# Altium schematic sheet wifi-bt.SchDoc
size A
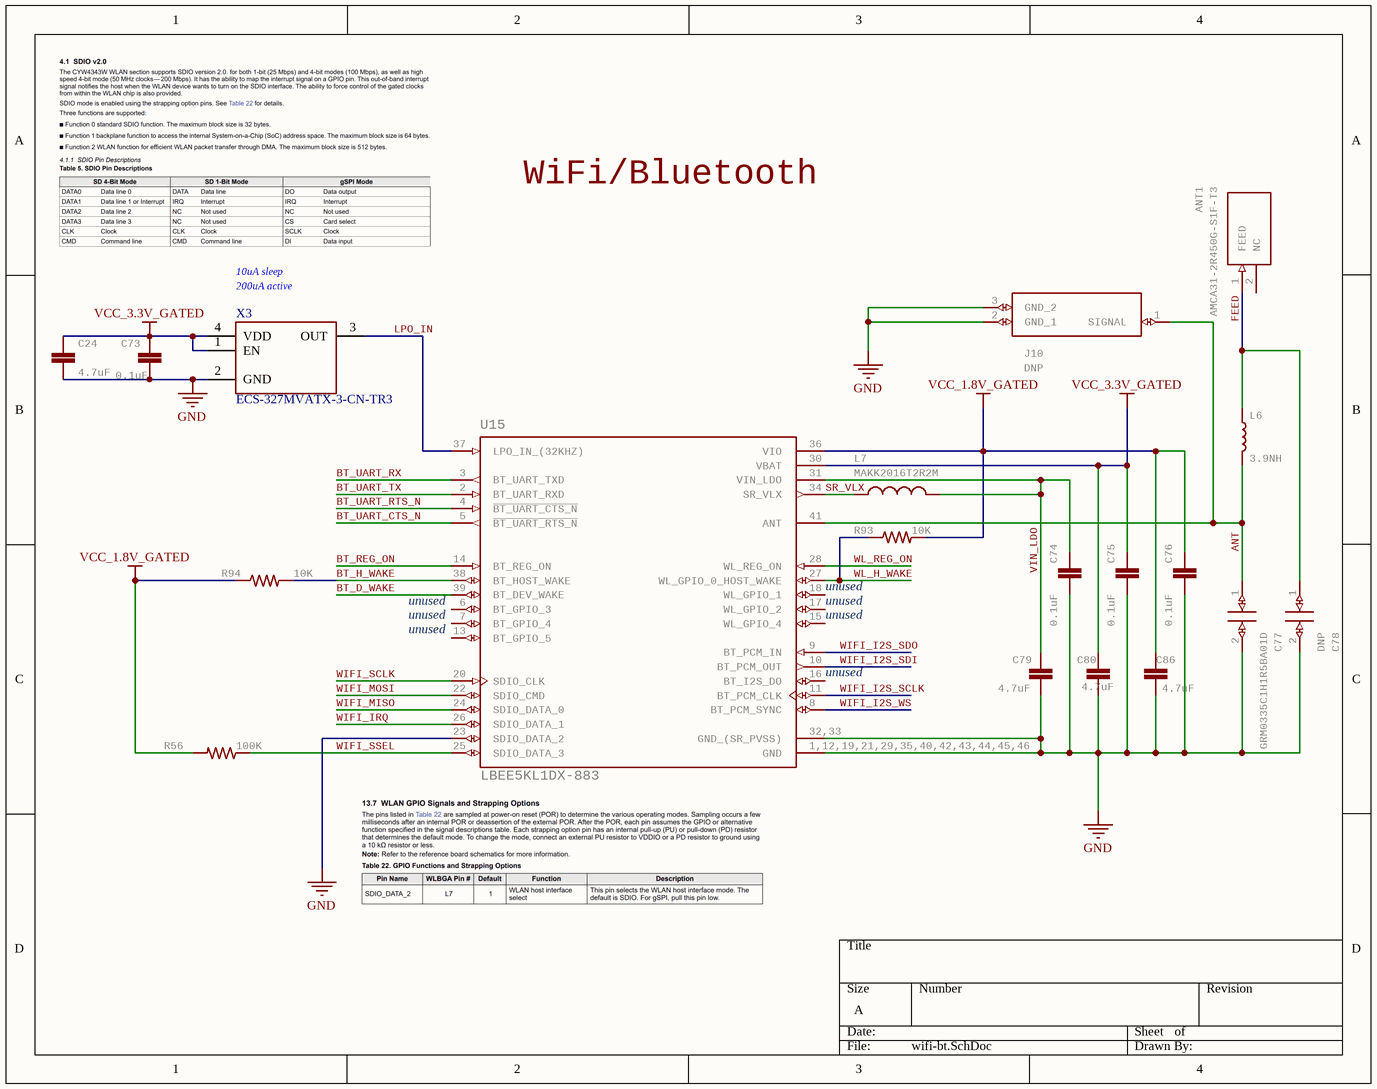
[diagram p0: wifi-bt.SchDoc]

## Parts
ANT1  AMCA31-2R450G-S1F-T3  [ANTC3216X140N]
C24  4.7uF  [0402-CAP]
C73  0.1uF  [0402-CAP]
C74  0.1uF  [0402-CAP]
C75  0.1uF  [0402-CAP]
C76  0.1uF  [0402-CAP]
C77  GRM0335C1H1R5BA01D  [CAPC0603X33N]
C78  DNP  [C0201-NO-3D]
C79  4.7uF  [0402-CAP]
C80  4.7uF  [0402-CAP]
C86  4.7uF  [0402-CAP]
J10  DNP  [23370191-NO-3D]
L6  3.9NH  [0402]
L7  MAKK2016T2R2M  [INDC2016X100N]
R56  100K  [0402-RES]
R93  10K  [0402-RES]
R94  10K  [0402-RES]
U15  LBEE5KL1DX-883  [XCVR_LBEE5KL1DX-TEMP]
X3  ECS-327MVATX-3-CN-TR3  [XTAL_3225]

## Nets
GND: C24.1 C73.2 C74.2 C75.2 C76.2 C77.2 C78.2 C79.1 C80.1 C86.1 J10.2(GND_1) J10.3(GND_2) U15.1,12,19,21,29,35,40,42,43,44,45,46(GND) U15.23(SDIO_DATA_2) U15.32,33(GND_(SR_PVSS)) X3.2(GND)
VCC_1.8V_GATED: C76.1 C86.2 R56.2 R93.2 R94.1 U15.36(VIO)
VCC_3.3V_GATED: C24.2 C73.1 C75.1 C80.2 U15.30(VBAT) X3.1(EN) X3.4(VDD)
ANT: C77.1 J10.1(SIGNAL) L6.2 U15.41(ANT)
BT_D_WAKE: U15.39(BT_DEV_WAKE)
BT_H_WAKE: R94.2 U15.38(BT_HOST_WAKE)
BT_REG_ON: U15.14(BT_REG_ON)
BT_UART_CTS_N: U15.5(~{BT_UART_RTS_N})
BT_UART_RTS_N: U15.4(~{BT_UART_CTS_N})
BT_UART_RX: U15.3(BT_UART_TXD)
BT_UART_TX: U15.2(BT_UART_RXD)
FEED: ANT1.1(FEED) C78.1 L6.1
LPO_IN: U15.37(LPO_IN_(32KHZ)) X3.3(OUT)
SR_VLX: L7.1 U15.34(SR_VLX)
VIN_LDO: C74.1 C79.2 L7.2 U15.31(VIN_LDO)
WIFI_I2S_SCLK: U15.11(BT_PCM_CLK)
WIFI_I2S_SDI: U15.10(BT_PCM_OUT)
WIFI_I2S_SDO: U15.9(BT_PCM_IN)
WIFI_I2S_WS: U15.8(BT_PCM_SYNC)
WIFI_IRQ: U15.26(SDIO_DATA_1)
WIFI_MISO: U15.24(SDIO_DATA_0)
WIFI_MOSI: U15.22(SDIO_CMD)
WIFI_SCLK: U15.20(SDIO_CLK)
WIFI_SSEL: R56.1 U15.25(SDIO_DATA_3)
WL_H_WAKE: R93.1 U15.27(WL_GPIO_0_HOST_WAKE)
WL_REG_ON: U15.28(WL_REG_ON)

Not connected (* = marked no-connect by the designer): ANT1 2(NC); U15 6(BT_GPIO_3) 7(BT_GPIO_4) 13(BT_GPIO_5) 15(WL_GPIO_4) 16(BT_I2S_DO) 17(WL_GPIO_2) 18(WL_GPIO_1)

## Notes on the sheet
- WiFi/Bluetooth
- 10uA sleep
- (near X3) 200uA active
- (near U15) unused
- unused

## Library data of the parts
ANT1 = AMCA31-2R450G-S1F-T3: ABRACON - AMCA31-2R450G-S1F-T3 - ANTENNA, CHIP, 2.45GHZ, 50 OHM, 1206   Source:  Datasheet; GateName_1: G$1; SymbolName_1: AMCA31-2R450G-S1F-T3; LibraryName: AMCA31-2R450G-S1F-T3; DeviceSetName: AMCA31-2R450G-S1F-T3; HEIGHT: 1.4mm; MANUFACTURER_NAME: ABRACON; MANUFACTURER_PART_NUMBER: AMCA31-2R450G-S1F-T3; MOUSER_PART_NUMBER: 815-CA312R450GS1FT3; MOUSER_PRICE-STOCK: https://www.mouser.co.uk/ProductDetail/ABRACON/AMCA31-2R450G-S1F-T3?qs=AAveGqk956GLuOddQEK40Q%3D%3D; MPN: AMCA31-2R450G-S1F-T3; Part Number: AMCA31-2R450G-S1F-T3
C24 C79 C80 C86 = CAP0402-CAP: CapacitorStandard 0603 ceramic capacitor, and 0.1" leaded capacitor.; MPN: JMK105BBJ475MV-F; GateName_1: G$1; SymbolName_1: CAP; DeviceName: 0402-CAP; LibraryName: sfe; DeviceSetName: CAP; Part Number: JMK105BBJ475MV-F
C73-C76 = C-EUC0201: CAPACITOR, European symbol; MPN: C0402C104Z4VAC; GateName_1: G$1; SymbolName_1: C-EU; POPULARITY: 0; LibraryName: rcl; DeviceSetName: C-EU; SPICEPREFIX: C; Part Number: C0402C104Z4VAC
C77 = GRM0335C1H1R5BA01D: Chip Capacitor value 1R5   Source:  Datasheet; MANUFACTURER_NAME: Murata Electronics; GateName_1: G$1; SymbolName_1: GRM0335C1H1R5BA01D; LibraryName: GRM0335C1H1R5BA01D; DeviceSetName: GRM0335C1H1R5BA01D; HEIGHT: 0.33mm; MANUFACTURER_PART_NUMBER: GRM0335C1H1R5BA01D; MOUSER_PART_NUMBER: 81-GRM0335C1H1R5BA1D; MOUSER_PRICE-STOCK: https://www.mouser.co.uk/ProductDetail/Murata-Electronics/GRM0335C1H1R5BA01D?qs=7vGxPDjevFPFqveGwv%252BPUQ%3D%3D; MPN: GRM0335C1H1R5BA01D; Part Number: GRM0335C1H1R5BA01D
C78 = GRM0335C1H1R5BA01D: Chip Capacitor value 1R5   Source:  Datasheet; MANUFACTURER_NAME: Murata Electronics; GateName_1: G$1; POPULATE: 0; SymbolName_1: GRM0335C1H1R5BA01D; LibraryName: GRM0335C1H1R5BA01D; DeviceSetName: GRM0335C1H1R5BA01D; HEIGHT: 0.33mm; MANUFACTURER_PART_NUMBER: GRM0335C1H1R5BA01D; MOUSER_PART_NUMBER: 81-GRM0335C1H1R5BA1D; MOUSER_PRICE-STOCK: https://www.mouser.co.uk/ProductDetail/Murata-Electronics/GRM0335C1H1R5BA01D?qs=7vGxPDjevFPFqveGwv%252BPUQ%3D%3D; MPN: DNP; Part Number: DNP
J10 = 2337019-1: RF Connectors / Coaxial Connectors MicroCoax receptacle UMCC Gen 1   Source:  Datasheet; MANUFACTURER_NAME: TE Connectivity; GateName_1: G$1; POPULATE: 0; SymbolName_1: 2337019-1; LibraryName: 2337019-1; DeviceSetName: 2337019-1; HEIGHT: 1.4mm; MANUFACTURER_PART_NUMBER: 2337019-1; MOUSER_PART_NUMBER: 571-2337019-1; MOUSER_PRICE-STOCK: https://www.mouser.co.uk/ProductDetail/TE-Connectivity/2337019-1?qs=l4Gc20tDgJIuN7nS9rJkJw%3D%3D; MPN: DNP; Part Number: DNP
L6 = INDUCTOR-0402-3.9NH: Inductors    Resist changes in electrical current. Basically a coil of wire.   SparkFun Products:  SparkFun Load Cell Amplifier - HX711  IOIO-OTG - V2.2; MPN: L-07C3N9SV6T; GateName_1: G$1; PROD_ID: NDUC-13457; SymbolName_1: INDUCTOR; DeviceName: -0402-3.9NH; LibraryName: SparkFun-Coils; DeviceSetName: INDUCTOR; Part Number: L-07C3N9SV6T
L7 = MAKK2016T2R2M: INDUCTOR, METAL CORE Check availability; GateName_1: G$1; MF: Taiyo Yuden; SymbolName_1: MAKK2016T2R2M; LibraryName: MAKK2016T2R2M; DeviceSetName: MAKK2016T2R2M; AVAILABILITY: In Stock; MP: MAKK2016T2R2M; MPN: MAKK2016T2R2M; PACKAGE: 2016 Taiyo Yuden; PRICE: None; PURCHASE-URL: https://pricing.snapeda.com/search/part/MAKK2016T2R2M/?ref=eda; Part Number: MAKK2016T2R2M
R56 = RESISTOR0402-RES: ResistorBasic schematic elements and footprints for 0603, 1206, and PTH resistors.; MPN: AC0402FR-07100KL; GateName_1: G$1; SymbolName_1: RESISTOR; DeviceName: 0402-RES; LibraryName: sfe; DeviceSetName: RESISTOR; Part Number: AC0402FR-07100KL
R93 R94 = RESISTOR0402-RES: ResistorBasic schematic elements and footprints for 0603, 1206, and PTH resistors.; MPN: AC0402FR-1310K; GateName_1: G$1; SymbolName_1: RESISTOR; DeviceName: 0402-RES; LibraryName: sfe; DeviceSetName: RESISTOR; Part Number: AC0402FR-1310K
U15 = LBEE5KL1DX-TEMP: Broadcom Chipset for 802.11b/g/n + Bluetooth 4.1/EDR; GateName_1: G$1; MF: Murata Electronics; SymbolName_1: LBEE5KL1DX-TEMP; LibraryName: LBEE5KL1DX-TEMP; DeviceSetName: LBEE5KL1DX-TEMP; AVAILABILITY: Unavailable; MP: LBEE5KL1DX-TEMP; MPN: LBEE5KL1DX-883; PACKAGE: None; PRICE: None; Part Number: LBEE5KL1DX-883
X3 = ECS-327MVATX-3-CN-TR3: Part Number: ECS-327MVATX-3-CN-TR3; MPN: ECS-327MVATX-3-CN-TR3